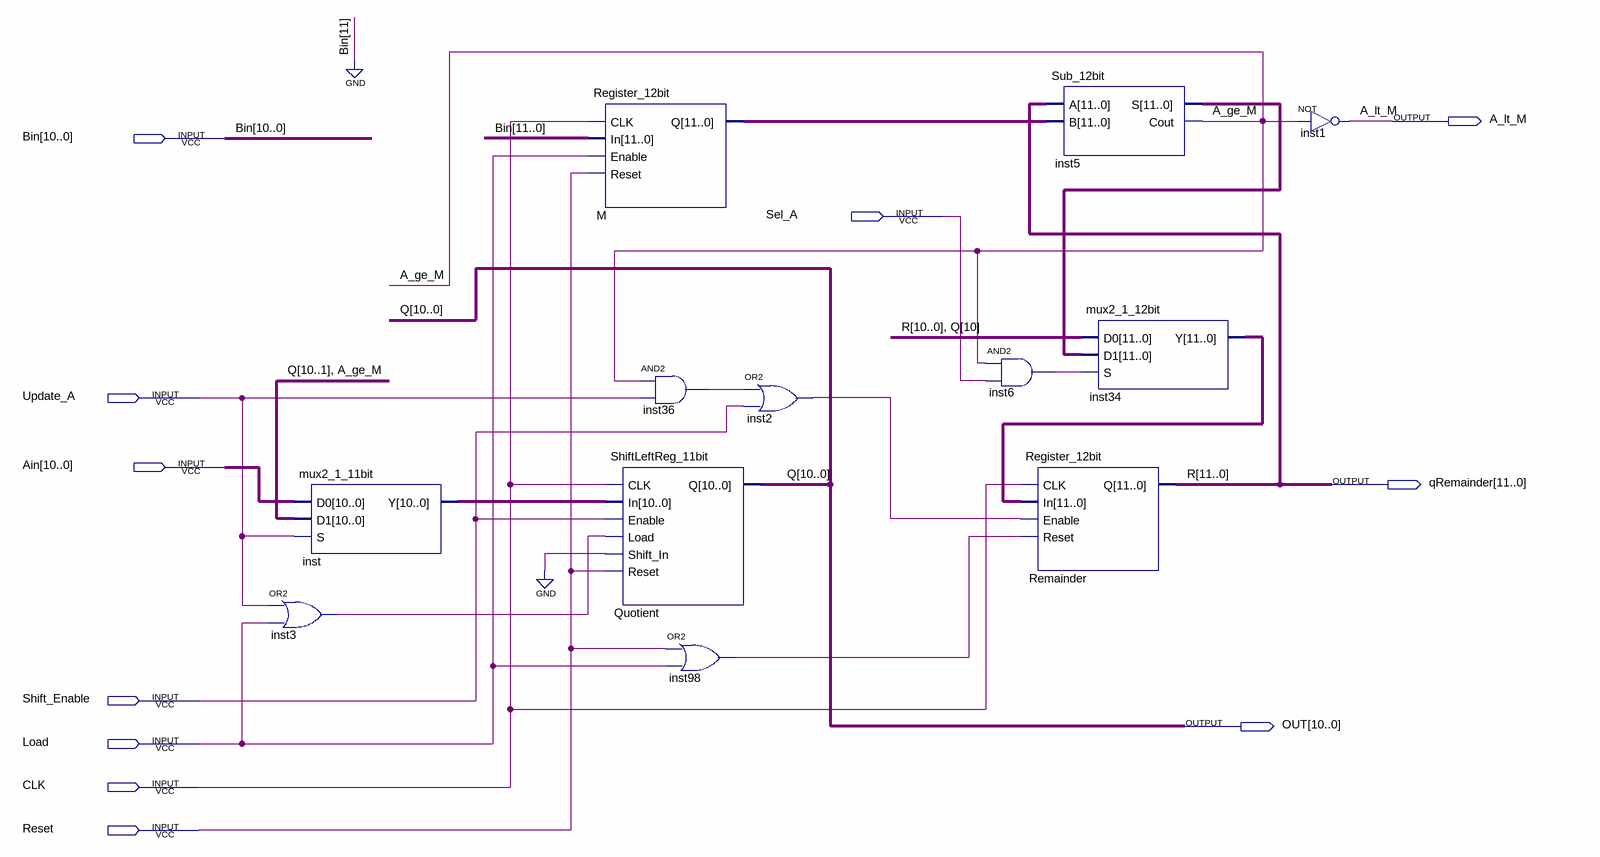
[diagram p0: schematic sheet]
// Quartus schematic Datapath_Div_22bit.bdf as structural Verilog: 12 symbols, 11 pins
module Datapath_Div_22bit (
  input  [10:0] Bin,
  input  Sel_A,
  input  Update_A,
  input  [10:0] Ain,
  input  Shift_Enable,
  input  Load,
  input  CLK,
  input  Reset,
  output A_lt_M,
  output [11:0] qRemainder,
  output [10:0] OUT
);

  wire A_ge_M, inst2_out, inst3_out, inst6_out, inst36_out, inst98_out;
  wire [10:0] inst_y;
  wire [11:0] inst5_s, inst34_y, M_q;

  or inst3 (inst3_out, Update_A, Load);
  mux2_1_11bit inst (.D0(Ain), .D1({OUT[10:1], A_ge_M}), .S(Update_A), .Y(inst_y));
  Register_12bit M (.CLK(CLK), .In({1'b0, Bin}), .Enable(Load), .Reset(Reset), .Q(M_q));
  ShiftLeftReg_11bit Quotient (
    .CLK(CLK), .In(inst_y), .Enable(Shift_Enable), .Load(inst3_out), .Shift_In(1'b0), .Reset(Reset), .Q(OUT));
  and inst36 (inst36_out, A_ge_M, Update_A);
  or inst98 (inst98_out, Reset, Load);
  or inst2 (inst2_out, inst36_out, Shift_Enable);
  Sub_12bit inst5 (.A(qRemainder), .B(M_q), .S(inst5_s), .Cout(A_ge_M));
  and inst6 (inst6_out, A_ge_M, Sel_A);
  Register_12bit Remainder (.CLK(CLK), .In(inst34_y), .Enable(inst2_out), .Reset(inst98_out), .Q(qRemainder));
  mux2_1_12bit inst34 (.D0({qRemainder[10:0], OUT[10]}), .D1(inst5_s), .S(inst6_out), .Y(inst34_y));
  not inst1 (A_lt_M, A_ge_M);

  // Other names for the same wires on the sheet: Q[10:0] = OUT; R[11:0] = qRemainder
endmodule
